# Altium schematic sheet LED.SchDoc: Neopixel
size A; DrawnBy: Sindre Hovland; Organization: Open sauce; Revision: V0; SheetNumber: 5; SheetTotal: 5
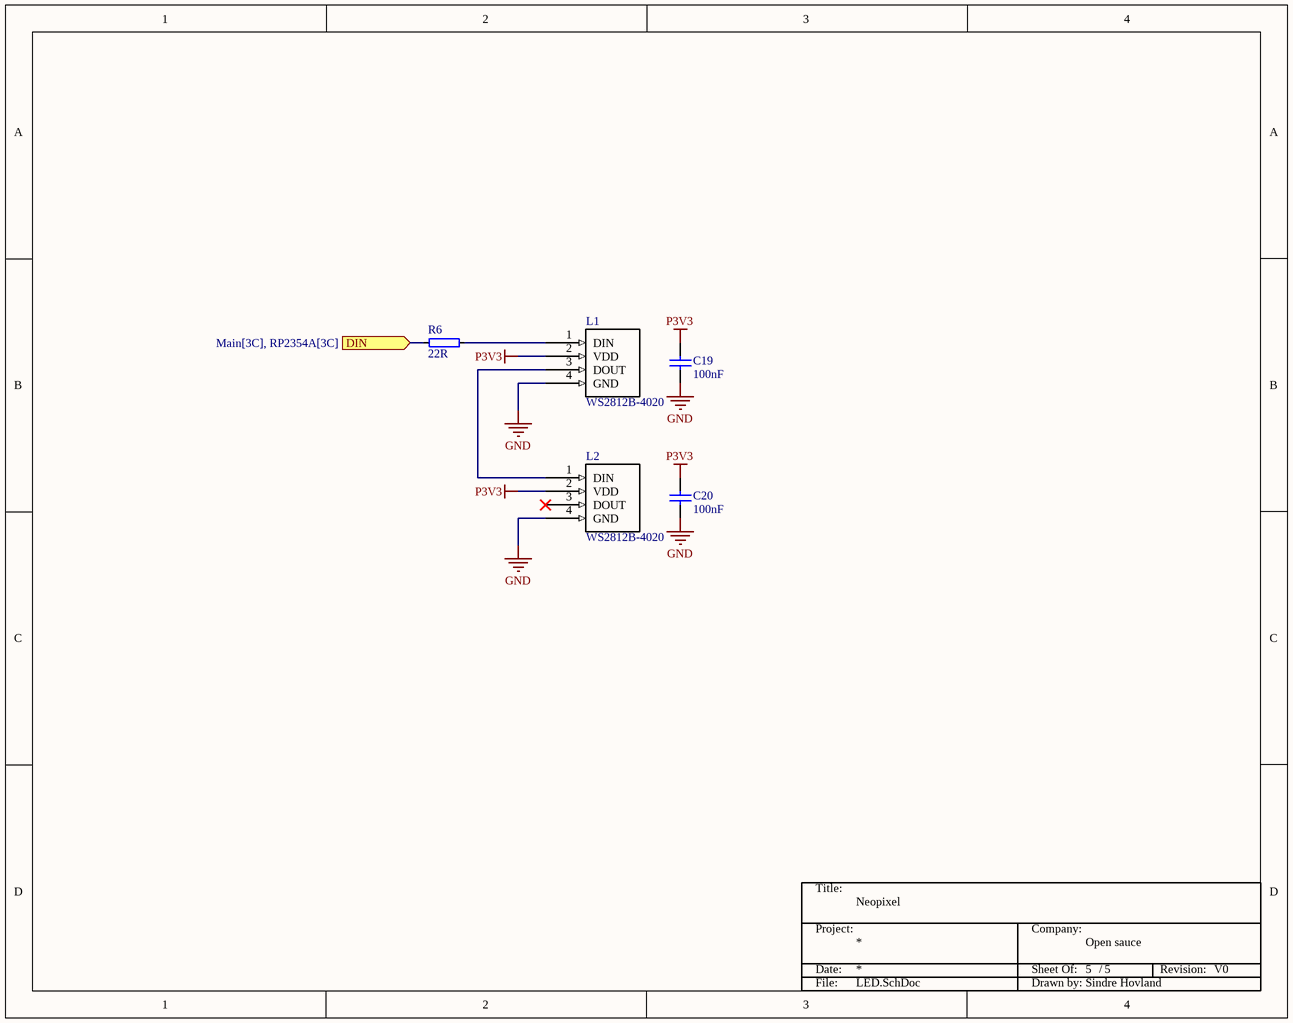
[diagram p0: LED.SchDoc]

## Parts
*?  TitleBlock  (value not drawn)  (graphical)
C19  100nF  [C0201]
C20  100nF  [C0201]
L1  WS2812B-4020  [WS2812B-4020-Footprint-1]
L2  WS2812B-4020  [WS2812B-4020-Footprint-1]
R6  22R  [R0201]

## Ports
DIN (in, see Main[3C], RP2354A[3C])

## Nets
GND: C19.1 C20.1 L1.4(GND) L2.4(GND)
P3V3: C19.2 C20.2 L1.2(VDD) L2.2(VDD)
DIN: R6.2 ; port DIN
NetL1_1: L1.1(DIN) R6.1
NetL1_3: L1.3(DOUT) L2.1(DIN)

Not connected (* = marked no-connect by the designer): L2 3(DOUT)*

## Notes on the sheet
- (in symbol TitleBlock) Title:; Project:; Company:; Date:; Sheet Of:; /; Revision:; File:; Drawn by:

## Library data of the parts
C19 C20 = CAP: Capacitor; Value: 100pF; Published: 8-Jun-2000; Revision: July-2002: Re-released for DXP Platform.; Publisher: Altium Limited
L1 L2 = WS2812B-4020: WS2812B based adressable led 90 deg 0402 mini; ComponentLink2URL: https://datasheet.lcsc.com/lcsc/2012110135_Worldsemi-WS2812B-4020_C965557.pdf; ComponentLink2Description: Datasheet; MPN: WS2812B-4020; ComponentLink1Description: China; ComponentLink1URL: https://www.youtube.com/watch?v=W8x4m-qpmJ8
R6 = RES: Resistor, Generic; Part Number: R0201-0R; Part number IPS: 00000003245; Value: 0R; Note: Chip Res 5%; Artikkelnr Noca: N.A.; Manufacturer: *; Manufacturer Part Number: *; ComponentLink1URL: *; ComponentLink1Description: Datasheet; ComponentLink2URL: *; ComponentLink2Description: Supplier link; HelpURL: *; Footprint Doc: 0201; LatestRevisionDate: 2017-11-09; Pin Count: 2; Publisher: Nordic Semiconductor; Published: 2014-11-13; Supplier 1: *; Supplier Part Number 1: *; Supplier 2: *; Supplier Part Number 2: *